# Altium schematic sheet Peripherals.SchDoc
size A4; SheetNumber: 2; SheetTotal: 3
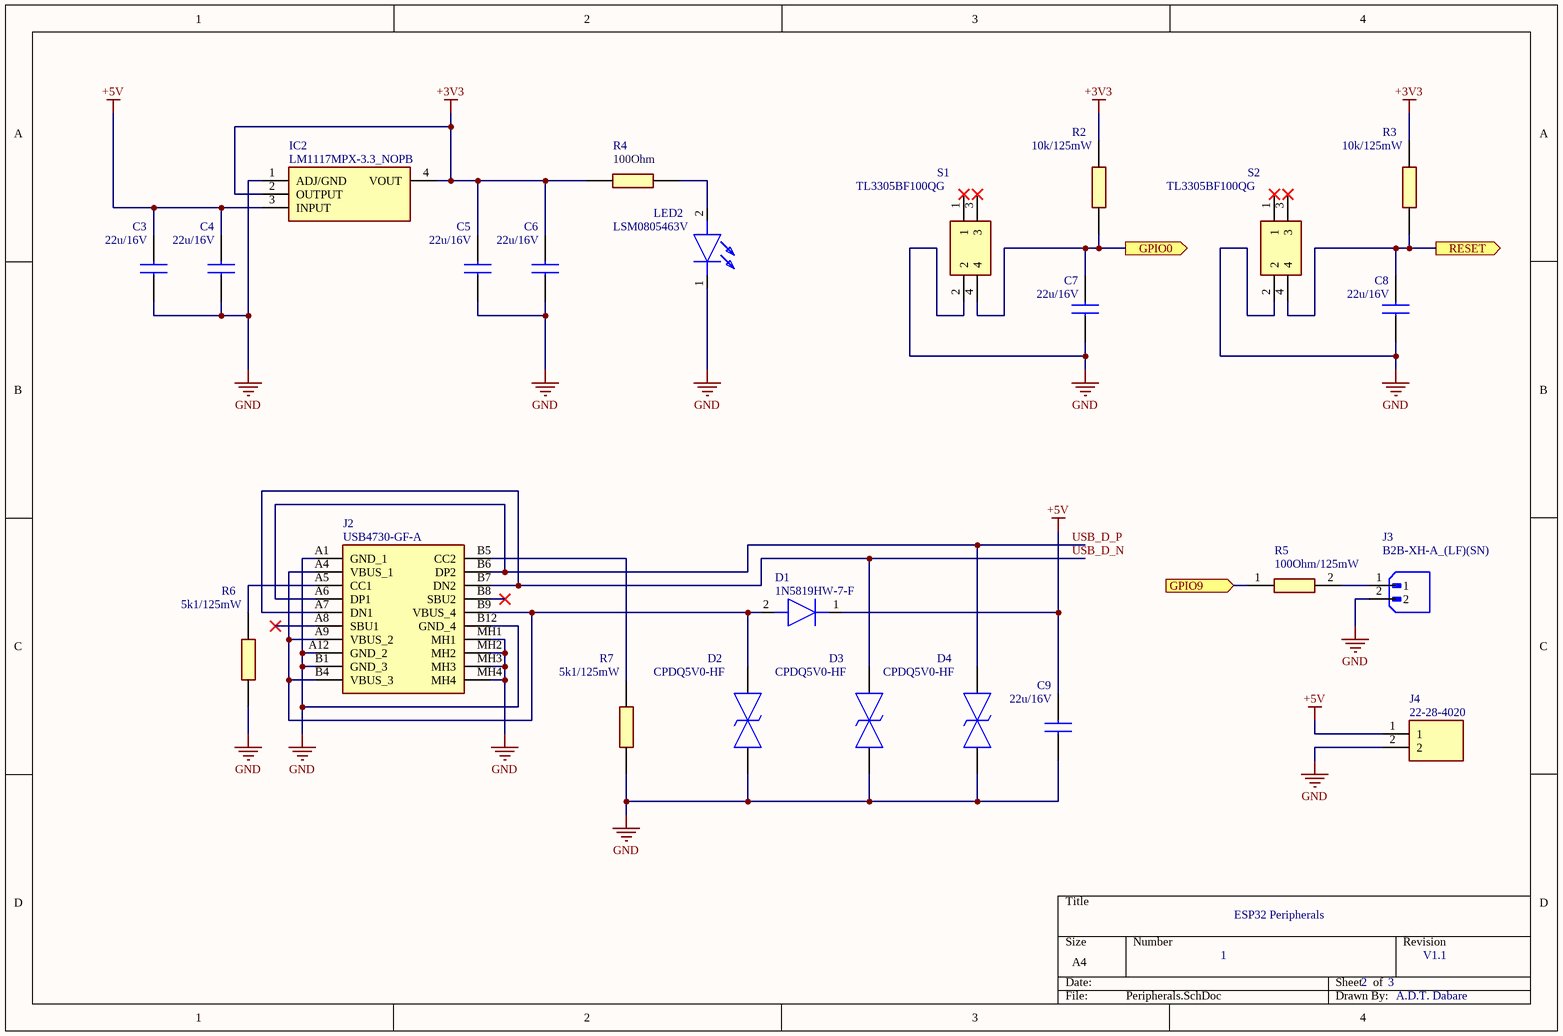
[diagram p0: Peripherals.SchDoc]

## Parts
C3  22u/16V  [CAPC2012X94N]
C4  22u/16V  [C0805]
C5  22u/16V  [CAPC2012X94N]
C6  22u/16V  [C0805]
C7  22u/16V  [C0805]
C8  22u/16V  [C0805]
C9  22u/16V  [CAPC2012X94N]
D1  1N5819HW-7-F  [SOD3716X145N]
D2  CPDQ5V0-HF  [SODFL1006X40N]
D3  CPDQ5V0-HF  [SODFL1006X40N]
D4  CPDQ5V0-HF  [SODFL1006X40N]
IC2  LM1117MPX-3.3_NOPB  [SOT230P700X180-4N]
J2  USB4730-GF-A  [USB4730GFA]
J3  B2B-XH-A_(LF)(SN)  [JST_B2B-XH-A_(LF)(SN)]
J4  22-28-4020  [HDRV2W66P0X254_1X2_508X249X838P]
LED2  LSM0805463V  [LEDC2012X90N]
R2  10k/125mW  [ERA6AEB101V]
R3  10k/125mW  [ERA6AEB101V]
R4  100Ohm  [ERA6AEB101V]
R5  100Ohm/125mW  [ERA6AEB101V]
R6  5k1/125mW  [ERA6AEB101V]
R7  5k1/125mW  [ERA6AEB101V]
S1  TL3305BF100QG  [TL3305BF160QG]
S2  TL3305BF100QG  [TL3305BF160QG]

## Ports
GPIO0 (out, see ESP32[3B]), GPIO9 (in, see ESP32[2C]), RESET (out, see ESP32[2B])

## Nets
+3V3: C5.1 C6.1 IC2.2(OUTPUT) IC2.4(VOUT) R2.2 R3.2 R4.1
+5V: C3.1 C4.1 C9.1 D1.1(K) IC2.3(INPUT) J4.1
GND: C3.2 C4.2 C5.2 C6.2 C7.2 C8.2 C9.2 D2.2 D3.2 D4.2 IC2.1(ADJ/GND) J2.A1(GND_1) J2.A12(GND_2) J2.B1(GND_3) J2.B12(GND_4) J2.MH1 J2.MH2 J2.MH3 J2.MH4 J3.2 J4.2 LED2.1(K) R6.2 R7.2 S1.2 S2.2
GPIO0: C7.1 R2.1 S1.4 ; port GPIO0
GPIO9: R5.1 ; port GPIO9
RESET: C8.1 R3.1 S2.4 ; port RESET
USB_D_N: D3.1 J2.A7(DN1) J2.B7(DN2)
USB_D_P: D4.1 J2.A6(DP1) J2.B6(DP2)
NetD1_2: D1.2(A) D2.1 J2.A4(VBUS_1) J2.A9(VBUS_2) J2.B4(VBUS_3) J2.B9(VBUS_4)
NetJ2_A5: J2.A5(CC1) R6.1
NetJ2_B5: J2.B5(CC2) R7.1
NetJ3_1: J3.1 R5.2
NetLED2_2: LED2.2(A) R4.2

Not connected (* = marked no-connect by the designer): J2 A8(SBU1)* B8(SBU2)*; S1 1* 3*; S2 1* 3*

## Notes on the sheet
- ESP32 Peripherals
- 1
- 2
- 3
- V1.1
- A.D.T. Dabare

## Library data of the parts
C3 C5 C9 = 0805YC106KAT2A: Multilayer Ceramic Capacitors MLCC - SMD/SMT KGM21AR71C106KU NEW GLOBAL PN 16V 10uF X A 581-KGM21AR71C106KU; Manufacturer_Name: Kyocera AVX; Datasheet Link: https://www.mouser.fr/datasheet/2/40/AVX_X7RDielectric_777024-1853642.pdf; Height: 0.94mm; Manufacturer_Part_Number: 0805YC106KAT2A; Mouser Part Number: 581-0805YC106KAT2A; Mouser Price/Stock: https://www.mouser.co.uk/ProductDetail/KYOCERA-AVX/0805YC106KAT2A?qs=3HJ2avRr9PKwMzeRMZhF2g%3D%3D; Arrow Part Number: 0805YC106KAT2A; Arrow Price/Stock: https://www.arrow.com/en/products/0805yc106kat2a/avx?region=nac
C4 C6-C8 = C0805X104K4RACAUTO: Multilayer Ceramic Capacitors MLCC - SMD/SMT 16V 0.1uF X7R 0805 10% Flex AEC-Q200; Manufacturer_Name: KEMET; Datasheet Link: https://content.kemet.com/datasheets/KEM_C1078_X7R_FT-CAP_AUTO_SMD.pdf; Height: 1.1mm; Manufacturer_Part_Number: C0805X104K4RACAUTO; Mouser Part Number: 80-C0805X104K4RAUTO; Mouser Price/Stock: https://www.mouser.co.uk/ProductDetail/KEMET/C0805X104K4RACAUTO?qs=PqoDHHvF64%2FAA39kqwjnIA%3D%3D; Arrow Part Number: C0805X104K4RACAUTO; Arrow Price/Stock: https://www.arrow.com/en/products/c0805x104k4racauto/kemet-corporation?utm_currency=USD&region=nac
D1 = 1N5819HW-7-F: Schottky Diodes & Rectifiers Vr/40V Io/1A T/R; Manufacturer_Name: Diodes Incorporated; Datasheet Link: https://www.diodes.com//assets/Datasheets/1N5819HW.pdf; Height: 1.45mm; Manufacturer_Part_Number: 1N5819HW-7-F; Mouser Part Number: 621-1N5819HW-F; Mouser Price/Stock: https://www.mouser.co.uk/ProductDetail/Diodes-Incorporated/1N5819HW-7-F?qs=NQ47qNm99eDyWTEd07miYA%3D%3D; Arrow Part Number: 1N5819HW-7-F; Arrow Price/Stock: https://www.arrow.com/en/products/1n5819hw-7-f/diodes-incorporated?region=nac
D2-D4 = CPDQ5V0-HF: ESD Protection Diodes / TVS Diodes SMD ESD Diode 5V Bi-Direction; Manufacturer_Name: Comchip Technology; Datasheet Link: https://datasheet.datasheetarchive.com/originals/distributors/Datasheets-DGA26/1842344.pdf; Height: 0.4mm; Manufacturer_Part_Number: CPDQ5V0-HF; Mouser Part Number: 750-CPDQ5V0-HF; Mouser Price/Stock: https://www.mouser.co.uk/ProductDetail/Comchip-Technology/CPDQ5V0-HF?qs=ccyN4P6STah119k8k5VB0Q%3D%3D; Arrow Part Number: CPDQ5V0-HF; Arrow Price/Stock: https://www.arrow.com/en/products/cpdq5v0-hf/comchip-technology?region=nac
IC2 = LM1117MPX-3.3_NOPB: LDO Voltage Regulators 800MA LDO LINEAR REG; Manufacturer_Name: Texas Instruments; Manufacturer_Part_Number: LM1117MPX-3.3/NOPB; Datasheet Link: http://www.ti.com/lit/ds/symlink/lm1117.pdf; Height: 1.8mm; Mouser Part Number: 926-LM1117MPX3.3NOPB; Mouser Price/Stock: https://www.mouser.co.uk/ProductDetail/Texas-Instruments/LM1117MPX-3.3-NOPB?qs=X1J7HmVL2ZHRbBIxXi4utg%3D%3D; Arrow Part Number: LM1117MPX-3.3/NOPB; Arrow Price/Stock: https://www.arrow.com/en/products/lm1117mpx-3.3nopb/texas-instruments?utm_currency=USD&region=nac
J2 = USB4730-GF-A: USB Connectors USB2.0 TypeC Recpt. CONNECTOR ONLY GF, 16P Horz T.Mt. SMT, IP67; Manufacturer_Name: GCT (GLOBAL CONNECTOR TECHNOLOGY); Datasheet Link: https://gct.co/files/drawings/usb4730.pdf; Height: 4.81mm; Manufacturer_Part_Number: USB4730-GF-A; Mouser Part Number: 640-USB4730GFA; Mouser Price/Stock: https://www.mouser.co.uk/ProductDetail/GCT/USB4730-GF-A?qs=Z%252BL2brAPG1KuvvEznGJ6ZQ%3D%3D
J3 = B2B-XH-A_(LF)(SN): Connector Header Through Hole 2 position 0.098 (2.50mm); MF: JST Sales; MP: B2B-XH-A (LF)(SN); SnapEDA_Link: https://www.snapeda.com/parts/B2B-XH-A%20(LF)(SN)/JST+Sales+America+Inc./view-part/?ref=snap; Package: None; Value: *; Check_prices: https://www.snapeda.com/parts/B2B-XH-A%20(LF)(SN)/JST+Sales+America+Inc./view-part/?ref=eda
J4 = 22-28-4020: Connector; Manufacturer_Name: Molex; Datasheet Link: https://www.mouser.com/datasheet/2/276/0022284020_PCB_HEADERS-228358.pdf; Height: 8.38mm; Manufacturer_Part_Number: 22-28-4020; Mouser Part Number: 538-22-28-4020; Mouser Price/Stock: https://www.mouser.co.uk/ProductDetail/Molex/22-28-4020?qs=d9fIA1aNikTifpx8PDmVSA%3D%3D
LED2 = LSM0805463V: Standard LEDs - SMD 0805 3V 100mcd Blue; Manufacturer_Name: Visual Communications Company; Datasheet Link: https://www.arrow.com/en/products/lsm0805463v/visual-communications; Height: 0.9mm; Manufacturer_Part_Number: LSM0805463V; Mouser Part Number: 593-LSM0805463V; Mouser Price/Stock: https://www.mouser.co.uk/ProductDetail/VCC/LSM0805463V?qs=T3oQrply3y%252B92KGe6UJ6%252BA%3D%3D; Arrow Part Number: LSM0805463V; Arrow Price/Stock: https://www.arrow.com/en/products/lsm0805463v/visual-communications?region=nac
R2 R3 = ERA-6APB103V: Thin Film Resistors - SMD 0805 10Kohm 0.1% 15ppm AEC-Q200; Manufacturer_Name: Panasonic; Datasheet Link: https://industrial.panasonic.com/cdbs/www-data/pdf/RDM0000/AOA0000C307.pdf; Height: 0.6mm; Manufacturer_Part_Number: ERA-6APB103V; Mouser Part Number: 667-ERA-6APB103V; Mouser Price/Stock: https://www.mouser.co.uk/ProductDetail/Panasonic/ERA-6APB103V?qs=ob%252BdNz2%252BYEhhgEYA52%2FHJA%3D%3D
R4 = ERA-6AHD120V: Thin Film Resistors - SMD 0805 12ohms 50ppm 0.5% AEC-Q200; Manufacturer_Name: Panasonic; Datasheet Link: https://industrial.panasonic.com/cdbs/www-data/pdf/RDM0000/AOA0000C307.pdf; Height: 0.6mm; Manufacturer_Part_Number: ERA-6AHD120V; Mouser Part Number: 667-ERA-6AHD120V; Mouser Price/Stock: https://www.mouser.co.uk/ProductDetail/Panasonic/ERA-6AHD120V?qs=MNPzkKEzRtR4QU3SwMNEXg%3D%3D
R5 = ERA-6AED560V: Thin Film Resistors - SMD 0805 56ohms 25ppm 0.5% AEC-Q200; Manufacturer_Name: Panasonic; Datasheet Link: https://industrial.panasonic.com/cdbs/www-data/pdf/RDM0000/AOA0000C307.pdf; Height: 0.6mm; Manufacturer_Part_Number: ERA-6AED560V
R6 R7 = ERA-6AED512V: Thin Film Resistors - SMD 0805 5100ohms 25ppm 0.5% AEC-Q200; Manufacturer_Name: Panasonic; Datasheet Link: https://industrial.panasonic.com/cdbs/www-data/pdf/RDM0000/AOA0000C307.pdf; Height: 0.6mm; Manufacturer_Part_Number: ERA-6AED512V; Mouser Part Number: 667-ERA-6AED512V; Mouser Price/Stock: https://www.mouser.co.uk/ProductDetail/Panasonic/ERA-6AED512V?qs=MNPzkKEzRtSyMhgZIjuV%252BA%3D%3D; Arrow Part Number: ERA-6AED512V; Arrow Price/Stock: https://www.arrow.com/en/products/era-6aed512v/panasonic?region=nac
S1 S2 = TL3305BF100QG: Tactile Switches TACT, 50mA, SPST-NO, Surface Mount; Manufacturer_Name: E-Switch; Datasheet Link: https://www.e-switch.com/wp-content/uploads/2024/08/TL3305.pdf; Manufacturer_Part_Number: TL3305BF100QG